# EAGLE design hybrid (EAGLE 8.0.2)

## Sheet 1 of 2
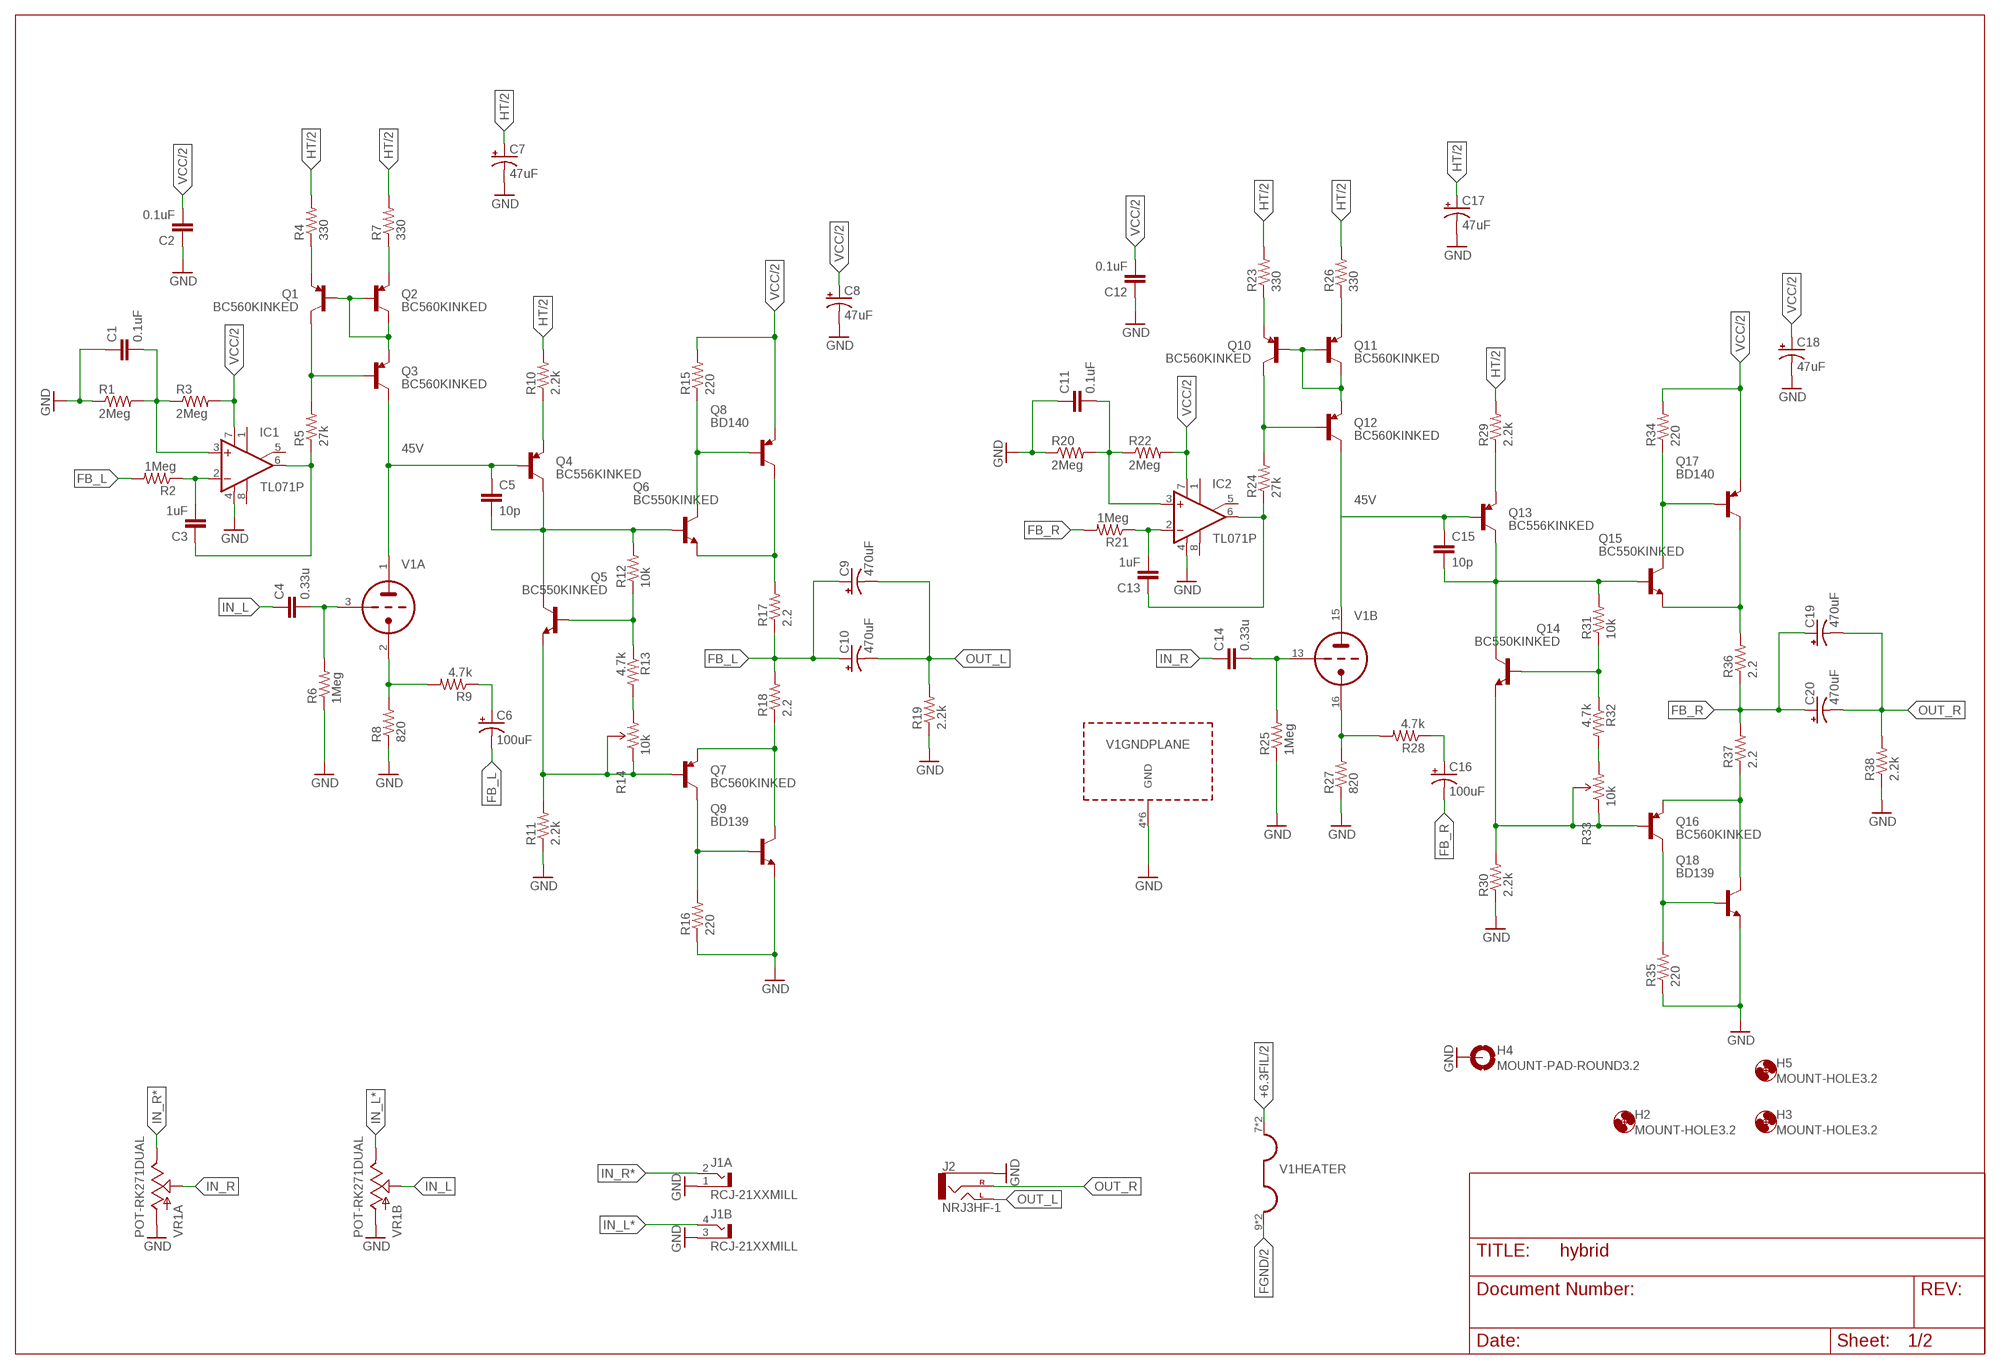
[diagram p0: schematic, sheet 1]

### Parts
C1  0.1uF  CAPPTH  [CAP-PTH-SMALL]
C2  0.1uF  CAPPTH  [CAP-PTH-SMALL]
C3  1uF  C5/5  [C5B5]
C4  0.33u  C5/3.5  [C5B3.5]
C5  10p  CAPPTH  [CAP-PTH-SMALL]
C6  100uF  CAP_POLPTH-8/3.5  [CPOL-RADIAL-8/3.5]
C7  47uF  CAP_POLPTH-8/3.5  [CPOL-RADIAL-8/3.5]
C8  47uF  CAP_POLPTH-8/3.5  [CPOL-RADIAL-8/3.5]
C9  470uF  CAP_POLPTH-12.5/5  [CPOL-RADIAL-12.5/5]
C10  470uF  CAP_POLPTH-12.5/5  [CPOL-RADIAL-12.5/5]
C11  0.1uF  CAPPTH  [CAP-PTH-SMALL]
C12  0.1uF  CAPPTH  [CAP-PTH-SMALL]
C13  1uF  C5/5  [C5B5]
C14  0.33u  C5/3.5  [C5B3.5]
C15  10p  CAPPTH  [CAP-PTH-SMALL]
C16  100uF  CAP_POLPTH-8/3.5  [CPOL-RADIAL-8/3.5]
C17  47uF  CAP_POLPTH-8/3.5  [CPOL-RADIAL-8/3.5]
C18  47uF  CAP_POLPTH-8/3.5  [CPOL-RADIAL-8/3.5]
C19  470uF  CAP_POLPTH-12.5/5  [CPOL-RADIAL-12.5/5]
C20  470uF  CAP_POLPTH-12.5/5  [CPOL-RADIAL-12.5/5]
H2  MOUNT-HOLE3.2  [3,2]
H3  MOUNT-HOLE3.2  [3,2]
H4  MOUNT-PAD-ROUND3.2  [3,2-PAD]
H5  MOUNT-HOLE3.2  [3,2]
IC1  TL071P  [DIL08]
IC2  TL071P  [DIL08]
J1  RCJ-21XXMILL  [RCJ-21-MILL]
J2  NRJ3HF-1  [NRJ3HF]
Q1  BC560KINKED  [TO92-BENT]
Q2  BC560KINKED  [TO92-BENT]
Q3  BC560KINKED  [TO92-BENT]
Q4  BC556KINKED  [TO92-BENT]
Q5  BC550KINKED  [TO92-BENT]
Q6  BC550KINKED  [TO92-BENT]
Q7  BC560KINKED  [TO92-BENT]
Q8  BD140  [TO126]
Q9  BD139  [TO126]
Q10  BC560KINKED  [TO92-BENT]
Q11  BC560KINKED  [TO92-BENT]
Q12  BC560KINKED  [TO92-BENT]
Q13  BC556KINKED  [TO92-BENT]
Q14  BC550KINKED  [TO92-BENT]
Q15  BC550KINKED  [TO92-BENT]
Q16  BC560KINKED  [TO92-BENT]
Q17  BD140  [TO126]
Q18  BD139  [TO126]
R1  2Meg  RESISTORPTH-1/4W  [AXIAL-0.4]
R2  1Meg  RESISTORPTH-1/4W  [AXIAL-0.4]
R3  2Meg  RESISTORPTH-1/4W  [AXIAL-0.4]
R4  330  RESISTORPTH-1/4W  [AXIAL-0.4]
R5  27k  RESISTORPTH-1/4W  [AXIAL-0.4]
R6  1Meg  RESISTORPTH-1/4W  [AXIAL-0.4]
R7  330  RESISTORPTH-1/4W  [AXIAL-0.4]
R8  820  RESISTORPTH-1/4W  [AXIAL-0.4]
R9  4.7k  RESISTORPTH-1/4W  [AXIAL-0.4]
R10  2.2k  RESISTORPTH-1/4W  [AXIAL-0.4]
R11  2.2k  RESISTORPTH-1/4W  [AXIAL-0.4]
R12  10k  RESISTORPTH-1/4W  [AXIAL-0.4]
R13  4.7k  RESISTORPTH-1/4W  [AXIAL-0.4]
R14  10k  TRIMPOT3362U-2  [3362U-2]
R15  220  RESISTORPTH-1/4W  [AXIAL-0.4]
R16  220  RESISTORPTH-1/4W  [AXIAL-0.4]
R17  2.2  RESISTORPTH-1/4W  [AXIAL-0.4]
R18  2.2  RESISTORPTH-1/4W  [AXIAL-0.4]
R19  2.2k  RESISTORPTH-1/4W  [AXIAL-0.4]
R20  2Meg  RESISTORPTH-1/4W  [AXIAL-0.4]
R21  1Meg  RESISTORPTH-1/4W  [AXIAL-0.4]
R22  2Meg  RESISTORPTH-1/4W  [AXIAL-0.4]
R23  330  RESISTORPTH-1/4W  [AXIAL-0.4]
R24  27k  RESISTORPTH-1/4W  [AXIAL-0.4]
R25  1Meg  RESISTORPTH-1/4W  [AXIAL-0.4]
R26  330  RESISTORPTH-1/4W  [AXIAL-0.4]
R27  820  RESISTORPTH-1/4W  [AXIAL-0.4]
R28  4.7k  RESISTORPTH-1/4W  [AXIAL-0.4]
R29  2.2k  RESISTORPTH-1/4W  [AXIAL-0.4]
R30  2.2k  RESISTORPTH-1/4W  [AXIAL-0.4]
R31  10k  RESISTORPTH-1/4W  [AXIAL-0.4]
R32  4.7k  RESISTORPTH-1/4W  [AXIAL-0.4]
R33  10k  TRIMPOT3362U-2  [3362U-2]
R34  220  RESISTORPTH-1/4W  [AXIAL-0.4]
R35  220  RESISTORPTH-1/4W  [AXIAL-0.4]
R36  2.2  RESISTORPTH-1/4W  [AXIAL-0.4]
R37  2.2  RESISTORPTH-1/4W  [AXIAL-0.4]
R38  2.2k  RESISTORPTH-1/4W  [AXIAL-0.4]
V1  6DJ8-P-HORIZONTAL  [NOVAL-HORIZONTAL]
VR1  POT-RK271DUAL  [RK271+PTD902]

### Nets
+6.3FIL [pwr]: V1.7(HEATER:H1) V1.8(HEATER:H1) ; also sheet 2
CAT_L: R8.P$2 R9.P$2 V1.2(A:TK)
CAT_R: R27.P$2 R28.P$2 V1.16(B:TK)
FB_L [out]: C6.2(-) C9.+ C10.+ R2.P$2 R17.P$1 R18.P$2
FB_R [out]: C16.2(-) C19.+ C20.+ R21.P$2 R36.P$1 R37.P$2
FGND [pwr]: V1.9(HEATER:H2) V1.10(HEATER:H2) ; also sheet 2
G_L: C4.2 R6.P$2 V1.3(A:TG)
G_R: C14.2 R25.P$2 V1.13(B:TG)
GND: C1.1 C2.1 C7.2(-) C8.2(-) C11.1 C12.1 C17.2(-) C18.2(-) H4.B3,2(MOUNT) IC1.4(V-) IC2.4(V-) J1.1(A:S) J1.3(B:S) J2.S(SLEEVE) Q9.1(E) Q18.1(E) R1.P$1 R6.P$1 R8.P$1 R11.P$1 R16.P$1 R19.P$1 R20.P$1 R25.P$1 R27.P$1 R30.P$1 R35.P$1 R38.P$1 V1.4(GNDPLANE:GND) V1.5(GNDPLANE:GND) V1.6(GNDPLANE:GND) V1.11(GNDPLANE:GND) V1.12(GNDPLANE:GND) V1.14(GNDPLANE:GND) VR1.1.1.1(A:A) VR1.1.1.2(A:A) VR1.2.1.1(B:A) VR1.2.1.2(B:A) ; also sheet 2
HT [pwr]: C7.1(+) C17.1(+) R4.P$2 R7.P$2 R10.P$2 R23.P$2 R26.P$2 R29.P$2 ; also sheet 2
IN_L: C4.1 VR1.2.2.1(B:S) VR1.2.2.2(B:S)
IN_L*: J1.4(B:T) VR1.2.3.1(B:E) VR1.2.3.2(B:E)
IN_R: C14.1 VR1.1.2(A:S)
IN_R*: J1.2(A:T) VR1.1.3.1(A:E) VR1.1.3.2(A:E)
ISET_L: Q1.1(C) Q3.2(B) R5.P$2
ISET_R: Q10.1(C) Q12.2(B) R24.P$2
N$1: Q1.2(B) Q2.1(C) Q2.2(B) Q3.3(E)
N$2: Q2.3(E) R7.P$1
N$3: Q1.3(E) R4.P$1
N$4: C6.1(+) R9.P$1
N$5: Q4.3(E) R10.P$1
N$7: C5.2 Q4.1(C) Q5.1(C) Q6.2(B) R12.P$2
N$8: Q5.2(B) R12.P$1 R13.P$1
N$10: R13.P$2 R14.3(CW)
N$11 [out]: Q6.3(E) Q8.2(C) R17.P$2
N$12: Q5.3(E) Q7.2(B) R11.P$2 R14.1(CCW) R14.2(WIPER)
N$13 [out]: Q7.3(E) Q9.2(C) R18.P$1
N$14: Q6.1(C) Q8.3(B) R15.P$1
N$15: Q7.1(C) Q9.3(B) R16.P$2
N$16: Q11.3(E) R26.P$1
N$17: Q10.2(B) Q11.1(C) Q11.2(B) Q12.3(E)
N$19: C16.1(+) R28.P$1
N$20: Q13.3(E) R29.P$1
N$21: C15.2 Q13.1(C) Q14.1(C) Q15.2(B) R31.P$2
N$22: Q14.2(B) R31.P$1 R32.P$1
N$23: R32.P$2 R33.3(CW)
N$24: Q14.3(E) Q16.2(B) R30.P$2 R33.1(CCW) R33.2(WIPER)
N$25 [out]: Q15.3(E) Q17.2(C) R36.P$2
N$26 [out]: Q16.3(E) Q18.2(C) R37.P$1
N$27: Q15.1(C) Q17.3(B) R34.P$1
N$28: Q16.1(C) Q18.3(B) R35.P$2
N$29: C3.1 IC1.6(OUT) R5.P$1
N$35: C3.2 IC1.2(-IN) R2.P$1
N$38: C1.2 IC1.3(+IN) R1.P$2 R3.P$1
N$39: Q10.3(E) R23.P$1
N$41: C13.1 IC2.6(OUT) R24.P$1
N$42: C13.2 IC2.2(-IN) R21.P$1
N$43: C11.2 IC2.3(+IN) R20.P$2 R22.P$1
OUT_L [out]: C9.- C10.- J2.T(LEFT) R19.P$2
OUT_R [out]: C19.- C20.- J2.R(RIGHT) R38.P$2
PL_L: C5.1 Q3.1(C) Q4.2(B) V1.1(A:TA)
PL_R: C15.1 Q12.1(C) Q13.2(B) V1.15(B:TA)
VCC [pwr]: C2.2 C8.1(+) C12.2 C18.1(+) IC1.7(V+) IC2.7(V+) Q8.1(E) Q17.1(E) R3.P$2 R15.P$2 R22.P$2 R34.P$2 ; also sheet 2
Unconnected: IC1.1(ON1) IC1.5(ON2) IC1.8(OPT) IC2.1(ON1) IC2.5(ON2) IC2.8(OPT)

### Notes on the sheet
- 45V
- 45V

## Sheet 2 of 2
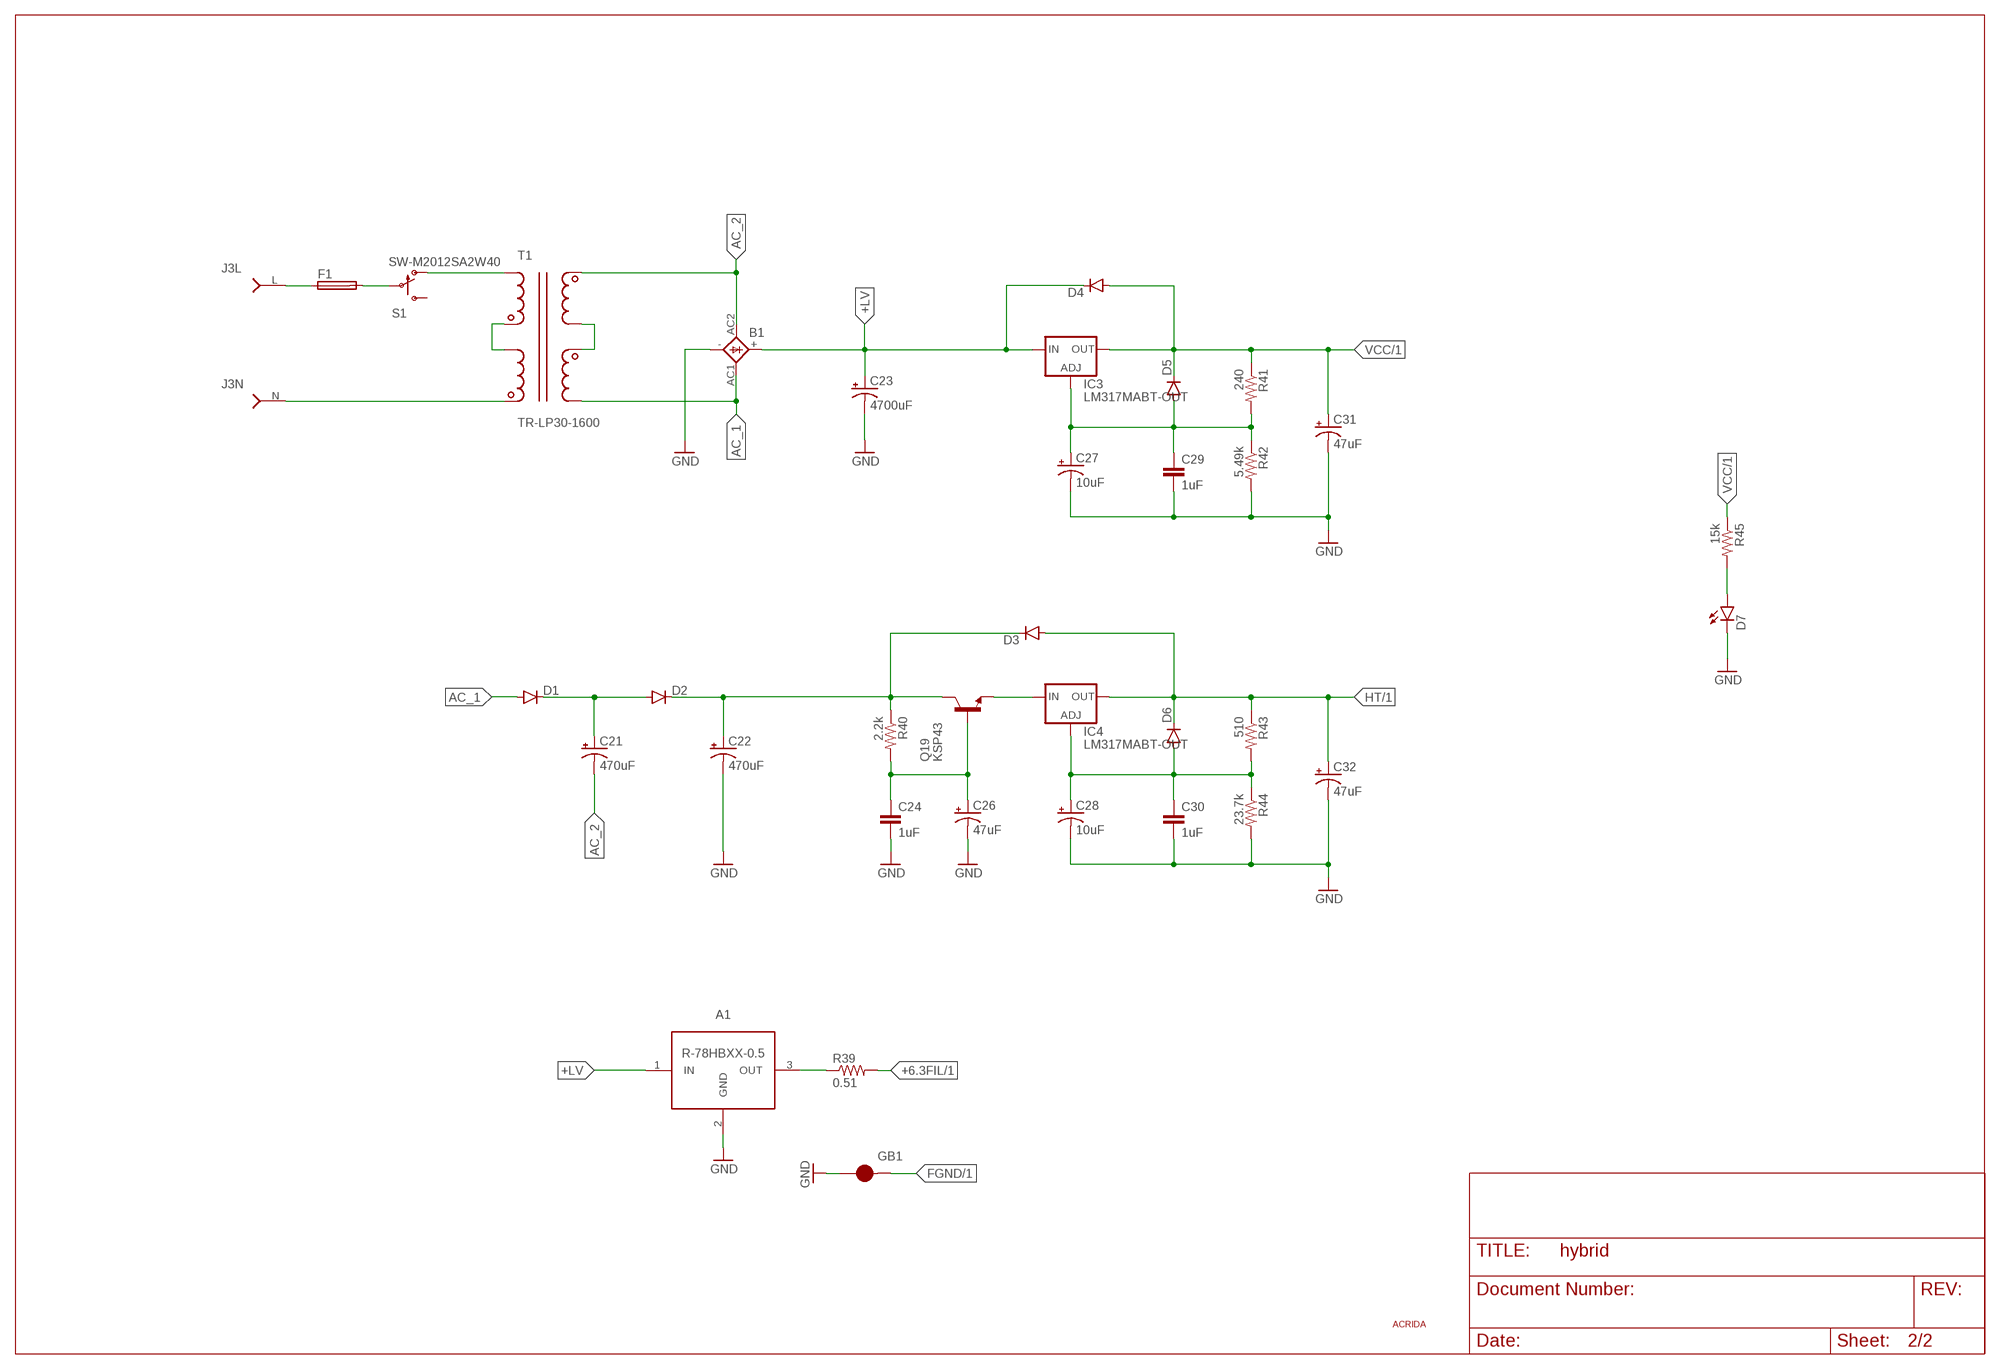
[diagram p1: schematic, sheet 2]

### Parts
A1  R-78HBXX-0.5  [R-78HB]
B1  GBU4  [GBU4S]
C21  470uF  CAP_POLPTH-18/7.5  [CPOL-RADIAL-18/7.5]
C22  470uF  CAP_POLPTH-18/7.5  [CPOL-RADIAL-18/7.5]
C23  4700uF  CAP_POLSNAPIN-30/10  [CPOL-SNAPIN-30/10]
C24  1uF  CAPPTH  [CAP-PTH-SMALL]
C26  47uF  CAP_POLPTH-12/5  [CPOL-RADIAL-12/5]
C27  10uF  CAP_POLPTH-5/2.5  [CPOL-RADIAL-5/2.5]
C28  10uF  CAP_POLPTH-6.5/2.5  [CPOL-RADIAL-6.5/2.5]
C29  1uF  CAPPTH  [CAP-PTH-SMALL]
C30  1uF  CAPPTH  [CAP-PTH-SMALL]
C31  47uF  CAP_POLPTH-8/3.5  [CPOL-RADIAL-8/3.5]
C32  47uF  CAP_POLPTH-8/3.5  [CPOL-RADIAL-8/3.5]
D1  DIODEPTH  [DIODE-1N4001]
D2  DIODEPTH  [DIODE-1N4001]
D3  DIODEPTH  [DIODE-1N4001]
D4  DIODEPTH  [DIODE-1N4001]
D5  DIODEPTH  [DIODE-1N4001]
D6  DIODEPTH  [DIODE-1N4001]
D7  LED3MM  [LED3MM]
F1  SH22,5  [SH22,5]
GB1  COPPER-BRIDGESM  [COPPER-BRIDGE-SM]
IC3  LM317MABT-OUT  [TO220L1-OUT]
IC4  LM317MABT-OUT  [TO220L1-OUT]
J3  703W-00/54  [703W-00/54]
Q19  KSP43  [TO-92]
R39  0.51  RESISTORPTH-1/2W  [AXIAL-0.5]
R40  2.2k  RESISTORPTH-1/4W  [AXIAL-0.4]
R41  240  RESISTORPTH-1/4W  [AXIAL-0.4]
R42  5.49k  RESISTORPTH-1/4W  [AXIAL-0.4]
R43  510  RESISTORPTH-1/4W  [AXIAL-0.4]
R44  23.7k  RESISTORPTH-1/4W  [AXIAL-0.4]
R45  15k  RESISTORPTH-1/4W  [AXIAL-0.4]
S1  SW-M2012SA2W40  [SW-M2012S2A2G40]
T1  TR-LP30-1600  [TR-LP30-1600]
U$1  ACRIDA-LOGO  [ACRIDA-LOGO]

### Nets
+6.3FIL [pwr]: R39.P$2 ; also sheet 1
+LV [pwr]: A1.1(IN) B1.+ C23.1(+) D4.C IC3.3(IN)
AC_1: B1.AC1(AC2) D1.A T1.8
AC_2: B1.AC2(AC1) C21.2(-) T1.5
FGND [pwr]: GB1.2 ; also sheet 1
GND: A1.2(GND) B1.- C22.2(-) C23.2(-) C24.2 C26.- C27.2(-) C28.2(-) C29.2 C30.2 C31.2(-) C32.2(-) D7.K(C) GB1.1 R42.P$2 R44.P$2 ; also sheet 1
HT [pwr]: C32.1(+) D3.A D6.C IC4.2(OUT) R43.P$1 ; also sheet 1
N$6: T1.2 T1.3
N$9: T1.6 T1.7
N$18: J3.N T1.1
N$30: C27.1(+) C29.1 D5.A IC3.1(ADJ) R41.P$2 R42.P$1
N$31 [pwr]: C21.1(+) D1.C D2.A
N$32 [pwr]: A1.3(OUT) R39.P$1
N$33 [pwr]: C22.1(+) D2.C D3.C Q19.3(C) R40.P$1
N$34: C24.1 C26.+ Q19.2(B) R40.P$2
N$36: C28.1(+) C30.1 D6.A IC4.1(ADJ) R43.P$2 R44.P$1
N$37 [pwr]: IC4.3(IN) Q19.1(E)
N$40: F1.1 J3.L
N$44: F1.2 S1.S(P)
N$45: S1.UP-CONNECT(O) T1.4
N$46: D7.A R45.P$2
VCC [pwr]: C31.1(+) D4.A D5.C IC3.2(OUT) R41.P$1 R45.P$1 ; also sheet 1
Unconnected: S1.DN-CONNECT(S)

## Power pins joined to a net without a drawn wire
P$1: J3.E

## Library data of the parts
A1 = my-smps:R-78HBXX-0.5: The R-78HBxx-Series high efficiency, high input voltage switching regulators are ideally suited to replace 78xx linear regulators and are pin compatible. http://www.mouser.com/ds/2/468/R-78HBxx-0.5_L-958370.pdf
B1 = rectifier:GBU4: GENERAL INSTRUMENT RECTIFIER
C1 C2 C5 C11 C12 C15 C24 C29 C30 = SparkFun-Capacitors:CAP: Capacitor Standard 0603 ceramic capacitor, and 0.1" leaded capacitor.
C3 C4 C13 C14 = capacitor-wima:C: CAPACITOR naming: grid - package width
C6-C10 C16-C23 C26-C28 C31 C32 = my-cap:CAP_POL: Capacitor Polarized These are standard SMD and PTH capacitors. Normally 10uF, 47uF, and 100uF in electrolytic and tantalum varieties. Always verify the external diameter of the through hole cap, it varies with capacity, voltage, and manufacturer. The EIA devices should be standard.
D1-D6 = SparkFun-DiscreteSemi:DIODE: Diode These are standard reverse protection diodes and small signal diodes. SMA package can handle up to about 1A. SOD-323 can handle about 200mA. What the SOD-323 package when ordering, there are some mfgs out there that are 5-pin packages.
D7 = SparkFun-LED:LED: LEDs Standard schematic elements and footprints for 5mm, 3mm, 1206, and 0603 sized LEDs. 5mm - Spark Fun Electronics SKU : COM-00529 (and others); PROD_ID: DIO-08794
F1 = fuse:SH22,5: FUSE HOLDER grid 22,5 mm, OGN0031 8201, Schurter (Buerklin); MF: SCHURTER; MPN: 0031.8201; OC_FARNELL: 1162740; OC_NEWARK: 96F8317
GB1 = my:COPPER-BRIDGE
H2 H3 H5 = holes:MOUNT-HOLE: MOUNTING HOLE with drill center marker
H4 = holes:MOUNT-PAD-ROUND: MOUNTING PAD, round
IC1 IC2 = linear:TL071: OP AMP
IC3 IC4 = my-reg:LM317?*: 500 mA Adjustable Output Positive Voltage Regulator Source: http://www.onsemi.co.jp .. LM317M-D.PDF
J1 = my:RCJ-21XX: Dual RCA Jack
J2 = my-conn:NRJ3HF-1: 1/4" Phone Jack
J3 = my-conn:703W-00/54: Qualtek 703W-00/54
Q1-Q3 Q7 Q10-Q12 Q16 = my-tran:BC560
Q4 Q13 = my-tran:BC556
Q5 Q6 Q14 Q15 = my-tran:BC550: NPN Epitaxial Silicon Transistor
Q8 Q17 = transistor-pnp:BD140: PNP Transistor
Q9 Q18 = transistor-npn:BD139*: NPN Transistor
Q19 = my-tran:KSP43
R1-R13 R15-R32 R34-R38 R40-R45 = SparkFun-Resistors:RESISTOR: Resistor Basic schematic elements and footprints for 0603, 1206, and PTH resistors.
R14 R33 = SparkFun-Electromechanical:TRIMPOT: Various small potentiometers for "set-and-forget" applications
R39 = my-res:RESISTOR: Resistor Basic schematic elements and footprints for 0603, 1206, and PTH resistors.
S1 = my-sw:SW-M2012SA2W40
T1 = my-transformers:TR-LP30-1600: http://www.mouser.com/ds/2/643/LP-892507.pdf
U$1 = my-logo:ACRIDA-LOGO
V1 = my-tubes:6DJ8-P-HORIZONTAL
VR1 = my:POT-RK271: 27mm Size Metal Shaft Type RK271 Series Rotary Potentiometer

## Net classes
1 out: width 0.813 mm
2 pwr: width 1.27 mm

## Board
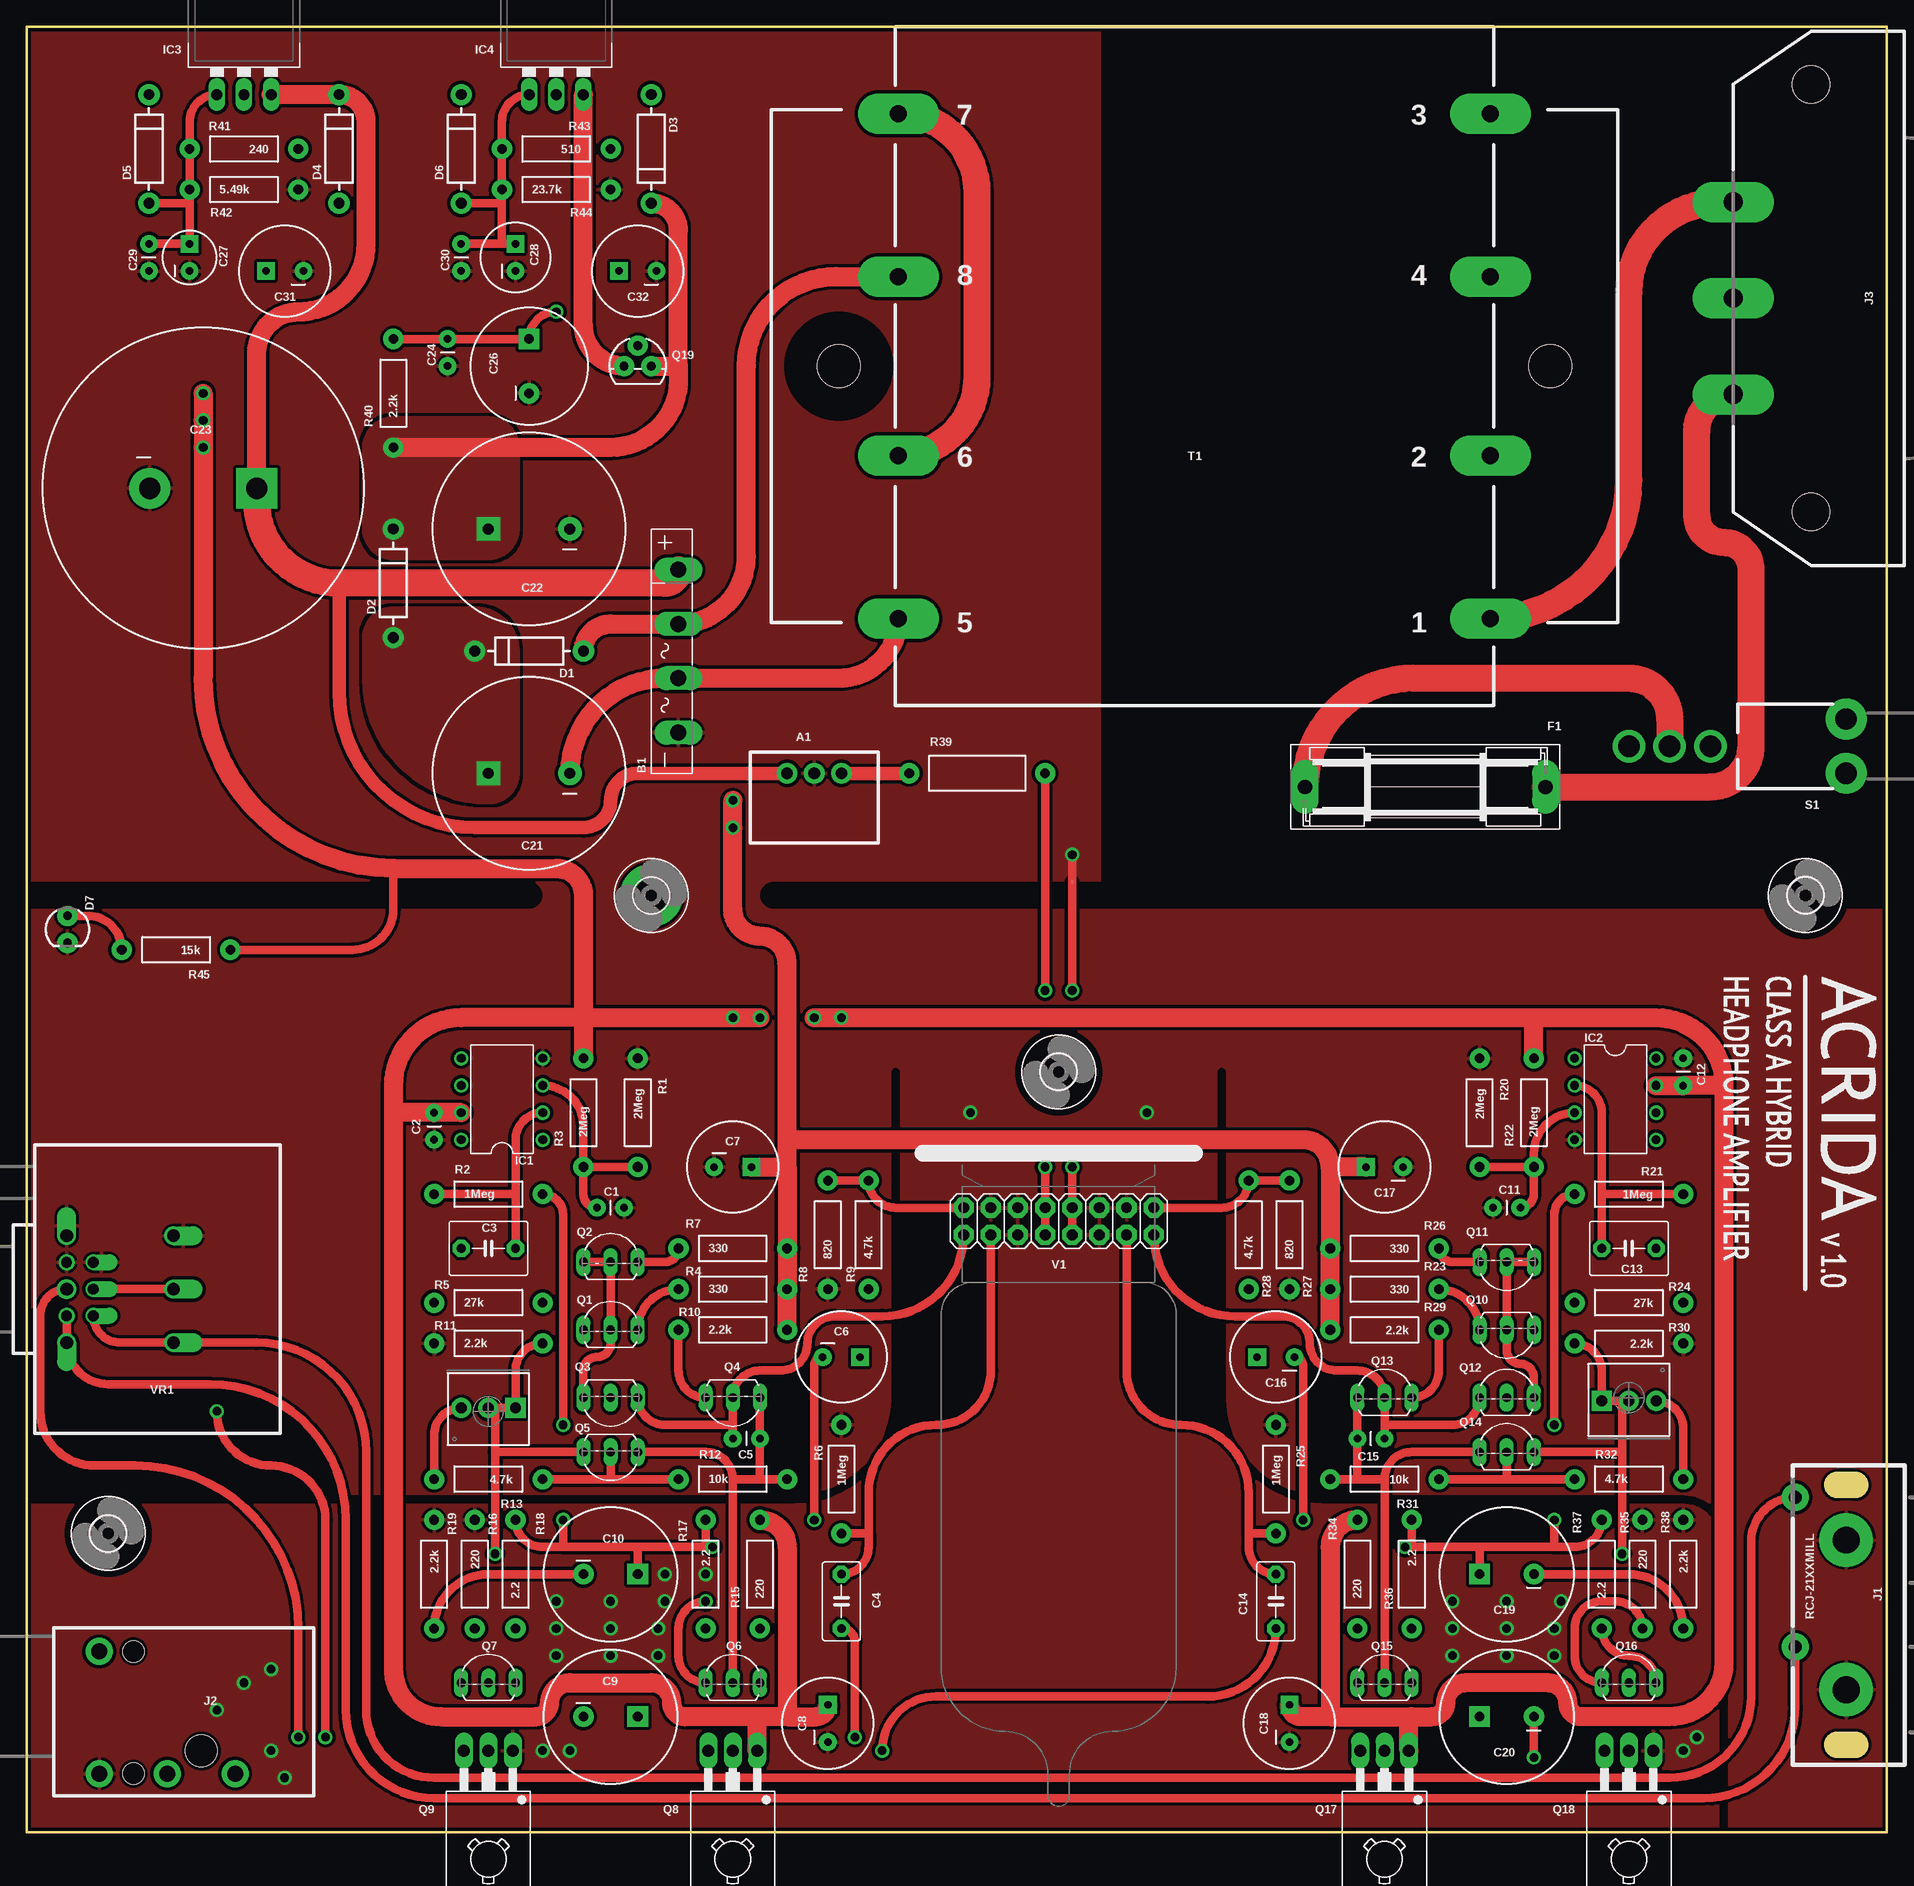
[diagram p2: board, top side]
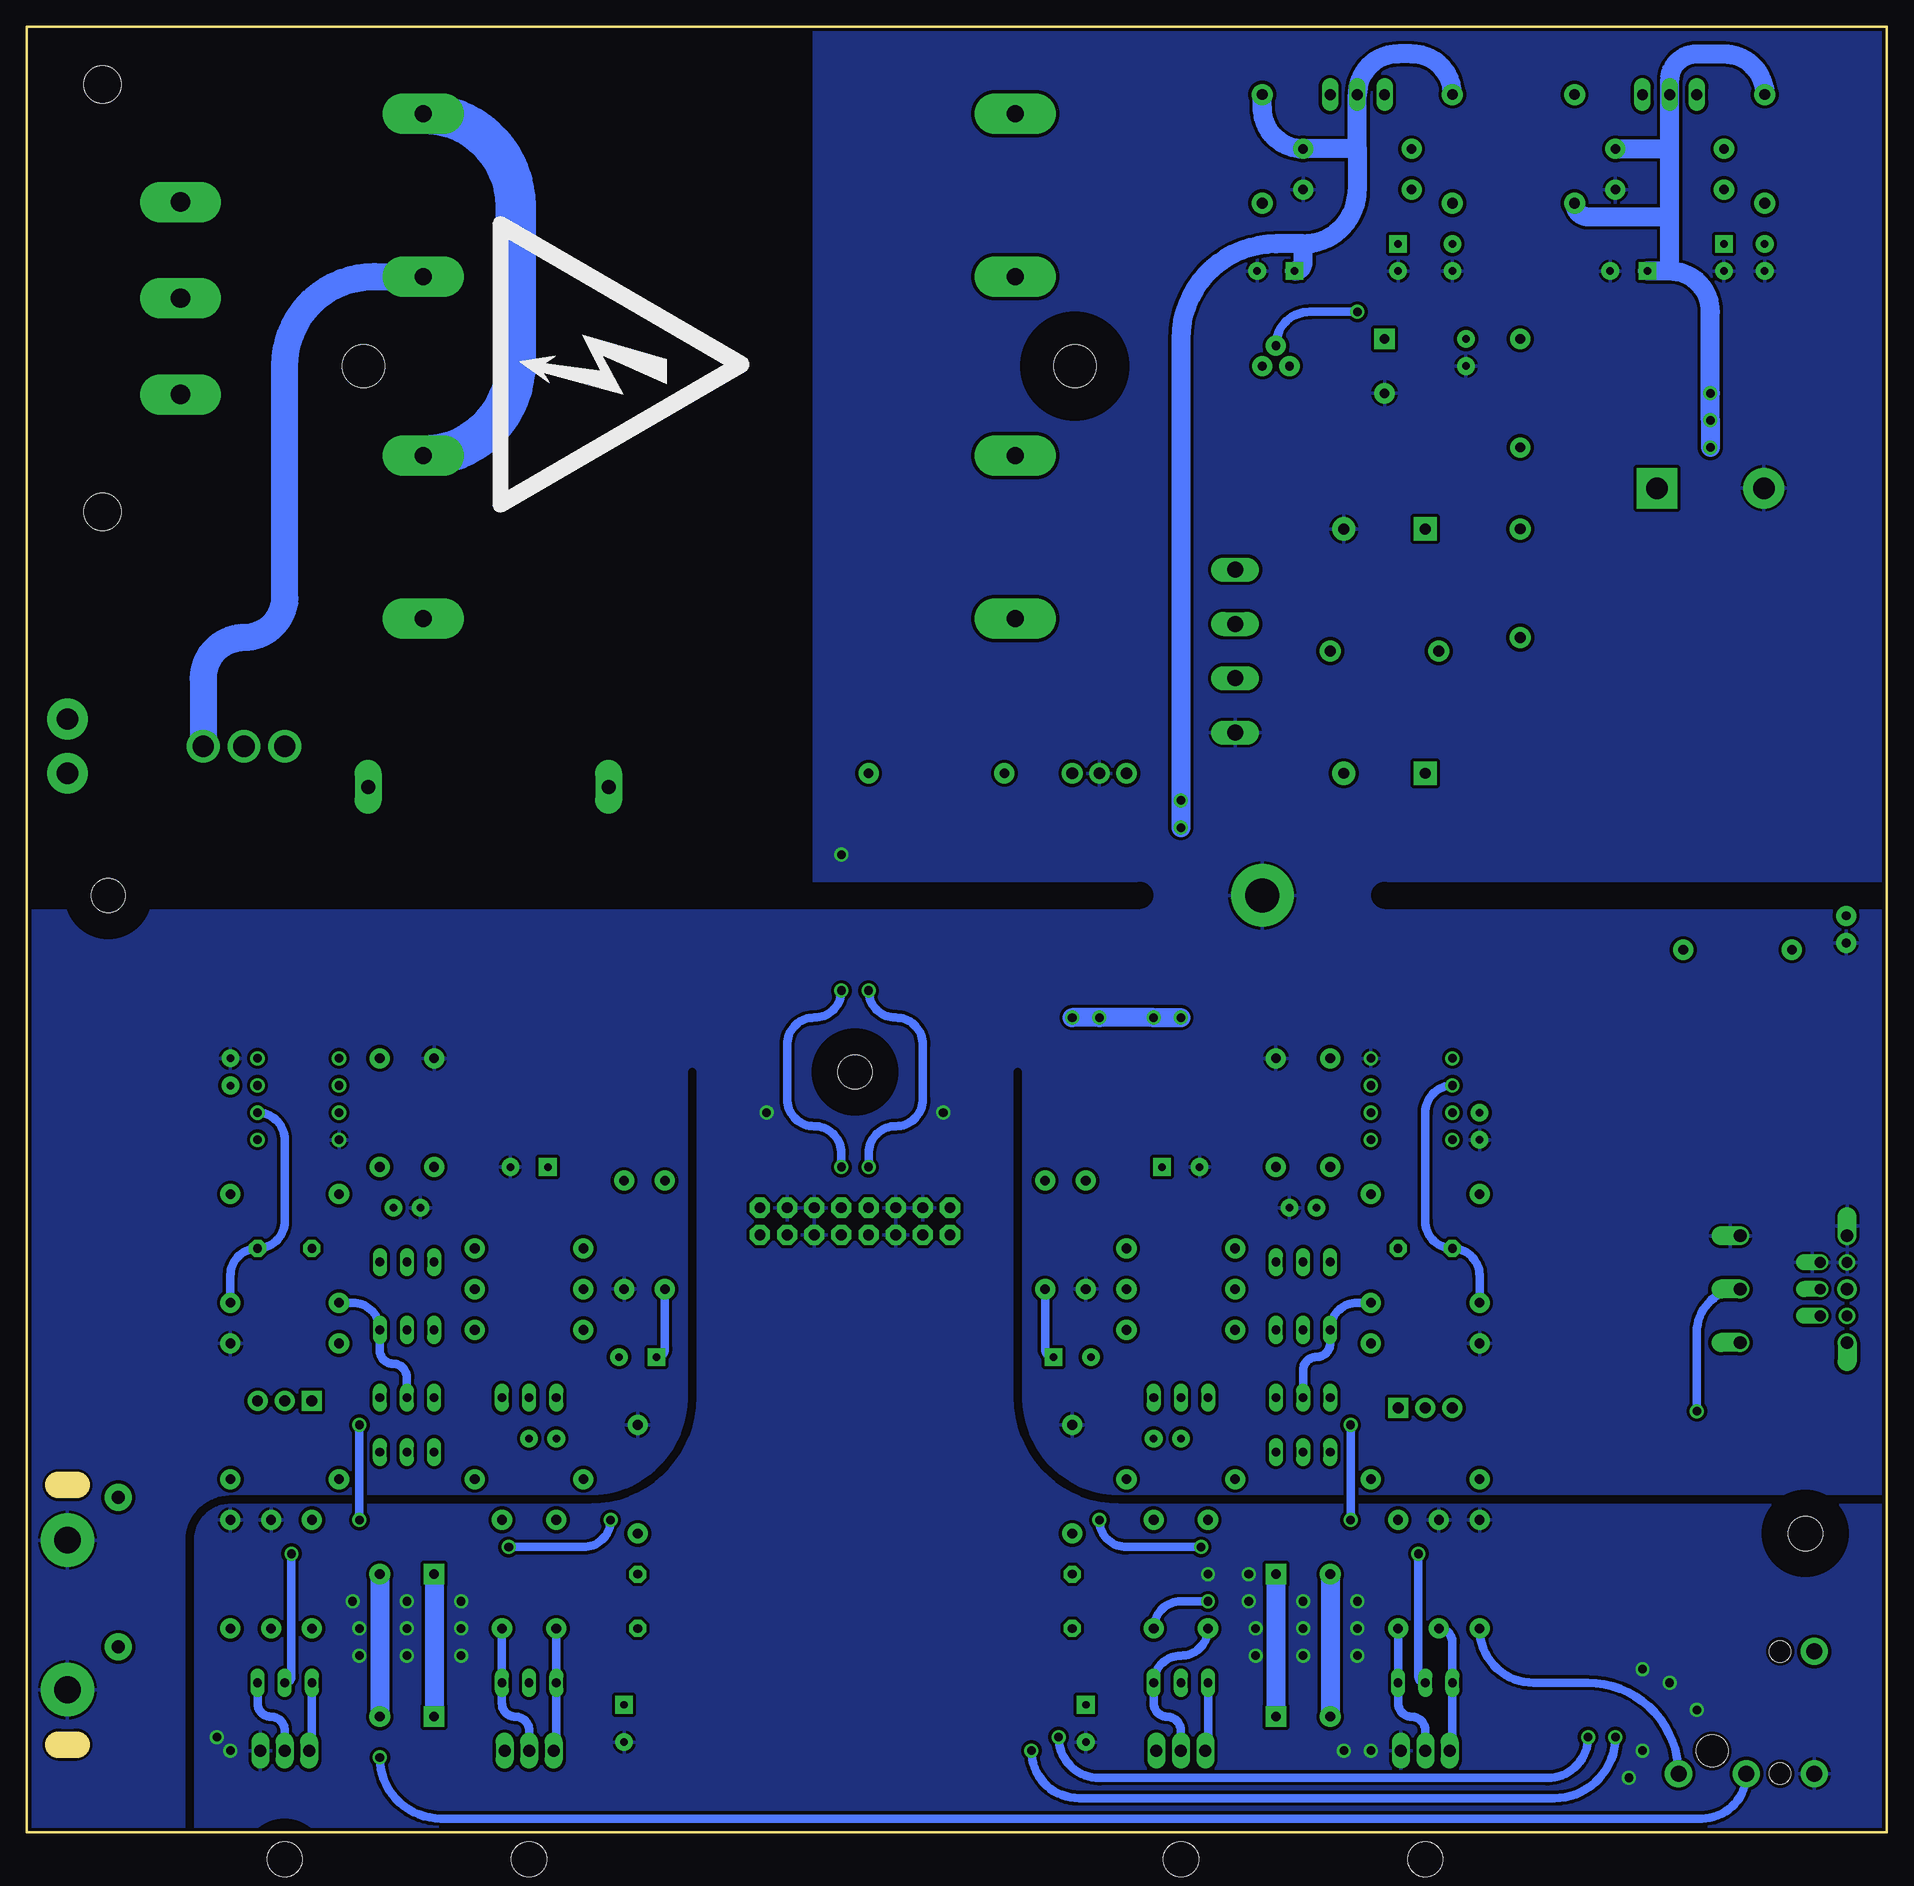
[diagram p3: board, bottom side, seen from below]

Size 173.99 x 168.91 mm. Coordinates in mm from the lower left corner, seen from the top.
Outline: 0,168.91 173.99,168.91 173.99,0 0,0 0,168.91
Copper layers (1*16): Top 0.035mm / dielectric 1.5mm / Bottom 0.035mm
Design rules "SeeedStudio_2layer_DRU_no_angle_20140221 *": minimum track width 12mil, minimum drill 12mil, track to track 12mil, track to pad 12mil, pad to pad 12mil, via to via 12mil, smd to smd 0mil, copper to edge 12mil, drill to drill 12mil, minimum pad ring 10mil, minimum via ring 10mil, stop-mask expansion 2mil, vias tented up to drill 100mil, thermal gap 10mil
tRestrict: 10 lines
bRestrict: 10 lines

### Footprints (pad centres in the part's own frame; a part is rotated, then mirrored left to right if it is on the bottom)
R-78HB = drill 1.1 pad 1.93: 1 -2.54,0; 2 0,0; 3 2.54,0
GBU4S = drill 1.499 long: + 7.62,0; - -7.62,0; AC1 2.54,0; AC2 -2.54,0
CAP-PTH-SMALL = drill 0.7 pad 1.651: 1 0,0; 2 2.54,0
C5B5 = drill 0.813 pad 1.6 octagon: 1 -2.54,0; 2 2.54,0
C5B3.5 = drill 0.813 pad 1.6 octagon: 1 -2.54,0; 2 2.54,0
CPOL-RADIAL-8/3.5 = drill 0.7 pad 1.651 square: 1 1.75,0 | drill 0.7 pad 1.651: 2 -1.75,0
CPOL-RADIAL-12.5/5 = drill 0.9 pad 1.93 square: + 2.54,0 | drill 0.9 pad 1.93: - -2.54,0
CPOL-RADIAL-18/7.5 = drill 1.016 pad 2.184 square: 1 3.81,0 | drill 1.016 pad 2.184: 2 -3.81,0
CPOL-SNAPIN-30/10 = drill 2 pad 3.81 square: 1 5,0 | drill 2 pad 3.81: 2 -5,0
CPOL-RADIAL-12/5 = drill 0.9 pad 1.93 square: + 2.54,0 | drill 0.9 pad 1.93: - -2.54,0
CPOL-RADIAL-5/2.5 = drill 0.7 pad 1.651 square: 1 1.27,0 | drill 0.7 pad 1.651: 2 -1.27,0
CPOL-RADIAL-6.5/2.5 = drill 0.7 pad 1.651 square: 1 1.27,0 | drill 0.7 pad 1.651: 2 -1.27,0
DIODE-1N4001 = drill 1 pad 1.981: A -5.08,0; C 5.08,0
LED3MM = drill 0.813 pad 1.88: A -1.27,0; K 1.27,0
SH22,5 = drill 1.321 pad 2.54 long: 1 -11.252,0; 2 11.252,0
COPPER-BRIDGE-SM = smd 0.203 x 0.203: 1 0,0; 2 0,0
3,2 = hole 3.2: 0,0
3,2-PAD = drill 3.2 pad 5.842: B3,2 0,0
DIL08 = drill 0.813 pad 1.27: 1 -3.81,-3.81; 2 -1.27,-3.81; 3 1.27,-3.81; 4 3.81,-3.81; 5 3.81,3.81; 6 1.27,3.81; 7 -1.27,3.81; 8 -3.81,3.81
TO220L1-OUT = drill 1.016 long: 1 -2.54,-3.81; 2 0,-3.81; 3 2.54,-3.81
RCJ-21-MILL = drill 2.5 pad 5: 1 7,0; 3 -7,0 | drill 1.2 pad 2.54: 2 3,-4.75; 4 -11,-4.75
NRJ3HF = drill 1.5 pad 2.54: G -4.25,-4.2; R -10.6,7.23; S -4.25,7.23; T -16.95,7.23 | hole 2: -7.45,7.23; -7.45,-4.2 | hole 3: -13.8,5.1
703W-00/54 = drill 1.8 pad 3.81 long: E 0,-9.3; L 9,-9.3; N -9,-9.3 | hole 3.5: -20,-2; 20,-2
TO92-BENT = drill 0.813 long: 1 -2.54,-1.27; 2 0,-1.27; 3 2.54,-1.27
TO126 = drill 1.118 long: 1 -2.286,-5.08; 2 0,-5.08; 3 2.286,-5.08 | hole 3.302: 0,5.08
TO-92 = drill 0.813 pad 1.88: 1 -1.27,0; 2 0,1.905; 3 1.27,0
AXIAL-0.4 = drill 0.9 pad 1.88: P$1 -5.08,0; P$2 5.08,0
3362U-2 = drill 1.016 pad 1.88 square: 1 -2.54,-0.305 | drill 1.016 pad 1.88: 2 0,-0.305; 3 2.54,-0.305
AXIAL-0.5 = drill 0.9 pad 1.88: P$1 -6.35,0; P$2 6.35,0
SW-M2012S2A2G40 = drill 2 pad 3.048: DN-CONNECT 0,20.32; S 0,16.51; UP-CONNECT 0,12.7 | drill 2 pad 3.81: G1 -2.54,0; G2 2.54,0
TR-LP30-1600 = drill 1.6 pad 3.81 long: 1 -27.686,23.622; 2 -27.686,8.382; 3 -27.686,-23.622; 4 -27.686,-8.382; 5 27.686,23.622; 6 27.686,8.382; 7 27.686,-23.622; 8 27.686,-8.382 | hole 4: -33.274,0; 33.274,0
NOVAL-HORIZONTAL = drill 1.016 pad 1.88 octagon: 1 -8.89,0; 2 -8.89,2.54; 3 -6.35,0; 4 -6.35,2.54; 5 -3.81,0; 6 -3.81,2.54; 7 -1.27,0; 8 -1.27,2.54; 9 1.27,0; 10 1.27,2.54; 11 3.81,0; 12 3.81,2.54; 13 6.35,0; 14 6.35,2.54; 15 8.89,0; 16 8.89,2.54
RK271+PTD902 = drill 1.2 offset: 1.1.1 -5,-5; 1.3.1 -5,5; 2.1.1 -15,-5; 2.2.1 -15,0; 2.3.1 -15,5 | drill 1: 1.1.2 -5,-2.5; 1.3.2 -5,2.5 | drill 1.2: 1.2 -5,0 | drill 1 offset: 2.1.2 -7.5,-2.5; 2.2.2 -7.5,0; 2.3.2 -7.5,2.5

### Placement (x,y rotation side)
A1  73.66,99.06 0 top
B1  60.96,110.49 90 top
C1  55.88,58.42 180 top
C2  38.1,64.77 90 top
C3  43.18,54.61 0 top
C4  76.2,21.59 90 top
C5  66.04,36.83 0 top
C6  76.2,44.45 0 top
C7  66.04,62.23 0 top
C8  74.93,10.16 90 top
C9  54.61,10.79 0 top
C10  54.61,24.13 0 top
C11  137.16,58.42 0 top
C12  154.94,72.39 270 top
C13  149.86,54.61 180 top
C14  116.84,21.59 90 top
C15  127,36.83 180 top
C16  116.84,44.45 180 top
C17  127,62.23 180 top
C18  118.11,10.16 90 top
C19  138.43,24.13 180 top
C20  138.43,10.79 180 top
C21  46.99,99.06 180 top
C22  46.99,121.92 180 top
C23  16.51,125.73 0 top
C24  39.37,139.7 270 top
C26  46.99,137.16 90 top
C27  15.24,147.32 90 top
C28  45.72,147.32 90 top
C29  11.43,148.59 270 top
C30  40.64,148.59 270 top
C31  24.13,146.05 180 top
C32  57.15,146.05 180 top
D1  46.99,110.49 180 top
D2  34.29,116.84 90 top
D3  58.42,157.48 270 top
D4  29.21,157.48 90 top
D5  11.43,157.48 90 top
D6  40.64,157.48 90 top
D7  3.81,84.45 270 top
F1  130.81,97.79 180 top
GB1  97.79,88.9 0 top
H2  166.37,87.63 0 top
H3  96.52,71.12 0 top
H4  58.42,87.63 0 top
H5  7.62,27.94 0 top
IC1  44.45,68.58 90 top
IC2  148.59,68.58 270 top
IC3  20.32,166.37 0 top
IC4  49.53,166.37 0 top
J1  170.18,20.32 270 top
J2  2.54,12.7 180 top
J3  168.91,143.51 270 top
Q1  54.61,48.26 0 top
Q2  54.61,54.61 0 top
Q3  54.61,39.37 180 top
Q4  66.04,39.37 180 top
Q5  54.61,34.29 180 top
Q6  66.04,15.24 0 top
Q7  43.18,15.24 0 top
Q8  66.04,2.54 180 top
Q9  43.18,2.54 180 top
Q10  138.43,45.72 180 top
Q11  138.43,52.07 180 top
Q12  138.43,41.91 0 top
Q13  127,41.91 0 top
Q14  138.43,36.83 0 top
Q15  127,15.24 0 top
Q16  149.86,15.24 0 top
Q17  127,2.54 180 top
Q18  149.86,2.54 180 top
Q19  57.15,137.16 0 top
R1  57.15,67.31 270 top
R2  43.18,59.69 0 top
R3  52.07,67.31 90 top
R4  66.04,50.8 0 top
R5  43.18,49.53 0 top
R6  76.2,33.02 270 top
R7  66.04,54.61 0 top
R8  74.93,55.88 90 top
R9  78.74,55.88 90 top
R10  66.04,46.99 0 top
R11  43.18,45.72 0 top
R12  66.04,33.02 0 top
R13  43.18,33.02 180 top
R14  43.18,39.37 180 top
R15  68.58,24.13 90 top
R16  41.91,24.13 270 top
R17  63.5,24.13 270 top
R18  45.72,24.13 90 top
R19  38.1,24.13 270 top
R20  135.89,67.31 270 top
R21  149.86,59.69 180 top
R22  140.97,67.31 90 top
R23  127,50.8 180 top
R24  149.86,49.53 180 top
R25  116.84,33.02 270 top
R26  127,54.61 180 top
R27  118.11,55.88 90 top
R28  114.3,55.88 90 top
R29  127,46.99 180 top
R30  149.86,45.72 180 top
R31  127,33.02 180 top
R32  149.86,33.02 0 top
R33  149.86,40.64 0 top
R34  124.46,24.13 90 top
R35  151.13,24.13 270 top
R36  129.54,24.13 270 top
R37  147.32,24.13 90 top
R38  154.94,24.13 270 top
R39  88.9,99.06 0 top
R40  34.29,134.62 90 top
R41  20.32,157.48 180 top
R42  20.32,153.67 0 top
R43  49.53,157.48 180 top
R44  49.53,153.67 0 top
R45  13.97,82.55 180 top
S1  170.18,101.6 90 top
T1  109.22,137.16 180 top
U$1  158.75,80.01 270 top
U$2  [DANGER-LOGO]  130.81,151.13 270 bottom
V1  96.52,55.88 0 top
VR1  -1.27,50.8 180 top

### Tracks (layer width: path | path; a pad name or v marks a point on that pad's centre or on a via)
+6.3FIL  (via drill 0.8)
  Top 0.813: v95.25,78.74 R39.P$2 | V1.7 V1.8 v95.25,62.23
  Bottom 0.813: v95.25,62.23 95.25,63.5 arc90 92.71,66.04 arc-90 90.17,68.58 90.17,73.66 arc-90 92.71,76.2 arc90 v95.25,78.74
+LV
  Top 1.27: A1.1 57.15,99.06 arc90 54.61,96.52 arc-90 52.07,93.98 41.91,93.98 arc-90 29.21,106.68 29.21,116.84
  Top 1.778: IC3.3 D4.C arc-90 31.75,160.02 31.75,148.59 arc-90 25.4,142.24 arc90 21.51,138.35 C23.1
  Top 2.54: B1.+ arc-90 59.69,116.84 29.21,116.84 arc-90 21.51,124.54 C23.1
AC_1
  Top 1.778: D1.A arc-90 54.61,113.03 B1.AC1 arc90 67.31,119.38 67.31,137.16 arc-90 75.69,145.54 T1.8
AC_2
  Top 1.778: C21.2 arc-90 59.69,107.95 B1.AC2 75.95,107.95 arc90 T1.5
CAT_L
  Top 0.813: R8.P$2 R9.P$2 arc90 81.28,58.42 V1.2
CAT_R
  Top 0.813: R27.P$2 R28.P$2 arc-90 111.76,58.42 V1.16
FB_L  (via drill 0.8)
  Top 0.813: v50.16,38.1 50.16,57.78 arc90 R2.P$2 | R18.P$2 arc90 48.26,26.67 50.16,26.67 | 57.15,26.67 63.5,26.67 | 50.16,26.67 57.15,26.67 | C10.+ 57.15,26.67 | v50.16,29.21 50.16,26.67 | R17.P$1 63.5,26.67 | 63.5,26.67 v64.14,26.67 | v73.66,29.21 73.66,43.66 arc-90 C6.2
  Bottom 0.813: v50.16,38.1 v50.16,29.21 | v73.66,29.21 arc-90 71.12,26.67 v64.14,26.67
  Bottom 1.778: C10.+ C9.+
FB_R  (via drill 0.8)
  Top 0.813: v142.88,38.1 142.88,57.78 arc-90 R21.P$2 | R37.P$2 arc-90 144.78,26.67 142.88,26.67 | 135.89,26.67 129.54,26.67 | 142.88,26.67 135.89,26.67 | C19.+ 135.89,26.67 | R36.P$1 129.54,26.67 | v142.88,29.21 142.88,26.67 | 129.54,26.67 v128.91,26.67 | v119.38,29.21 119.38,43.66 arc90 C16.2
  Bottom 0.813: v142.88,38.1 v142.88,29.21 | v128.91,26.67 121.92,26.67 arc-90 v119.38,29.21
  Bottom 1.778: C19.+ C20.+
FGND  (via drill 0.8)
  Top 0.813: v97.79,78.74 GB1.2 | V1.9 V1.10 v97.79,62.23
  Bottom 0.813: v97.79,62.23 97.79,63.5 arc-90 100.33,66.04 arc90 102.87,68.58 102.87,73.66 arc90 100.33,76.2 arc-90 v97.79,78.74
G_L
  Top 0.813: C4.2 arc90 78.74,26.67 78.74,27.94 | 78.74,27.94 78.74,31.75 arc-90 85.09,38.1 arc90 90.17,43.18 V1.3 | R6.P$2 78.74,27.94
G_R
  Top 0.813: C14.2 arc-90 114.3,26.67 114.3,27.94 | 114.3,27.94 114.3,31.75 arc90 107.95,38.1 arc-90 102.87,43.18 V1.13 | R25.P$2 114.3,27.94
GND  (via drill 0.8)
  Top 0.813: GB1.1 v97.79,91.44
  other vias: 49.53,21.59 49.53,19.05 49.53,16.51 59.69,21.59 59.69,24.13 63.5,24.13 54.61,21.59 54.61,19.05 54.61,16.51 59.05,16.51 138.43,16.51 138.43,19.05 138.43,21.59 133.35,21.59 133.35,19.05 133.35,16.51 143.51,21.59 142.88,19.05 142.88,16.51 59.05,19.05 22.86,7.62 17.78,11.43 20.32,13.97 22.86,15.24 24.13,5.08 88.27,67.31 104.78,67.31 154.94,7.62 156.21,8.89 48.26,7.62 50.8,7.62
  pour Bottom: 0,168.91 100.33,168.91 100.33,87.63 173.99,87.63 173.99,0 0,0
  pour Top (rank 2): 0,168.91 0,0 173.99,0 173.99,87.63 100.33,87.63 100.33,168.91
HT  (via drill 0.8)
  Top 1.778: R10.P$2 R4.P$2 R7.P$2 71.12,62.23 | R29.P$2 R23.P$2 R26.P$2 121.92,62.23 | 121.92,62.23 arc90 119.38,64.77 71.12,64.77 | C7.1 71.12,62.23 | C17.1 121.92,62.23 | 71.12,62.23 71.12,64.77 | v66.04,96.52 v66.04,93.98 66.04,86.36 arc90 68.58,83.82 arc-90 71.12,81.28 71.12,64.77
  Bottom 1.778: D6.C arc-90 44.45,166.37 45.72,166.37 arc-90 IC4.2 49.53,157.48 | 49.53,157.48 49.53,153.67 arc90 54.61,148.59 | 54.61,148.59 57.15,148.59 arc-90 66.04,139.7 v66.04,96.52 v66.04,93.98 | C32.1 arc-90 54.61,146.84 54.61,148.59 | 49.53,157.48 R43.P$1 arc90 58.42,161.29 D3.A
IN_L  (via drill 0.8)
  Top 0.813: VR1.2.2.2 VR1.2.2.1 | v17.78,39.37 arc90 22.86,34.29 arc-90 27.94,29.21 v27.94,8.89 | v77.47,8.89 77.47,17.78 arc90 C4.1
  Bottom 0.813: VR1.2.2.1 arc-90 17.78,46.75 v17.78,39.37 | v27.94,8.89 arc90 31.75,5.08 73.66,5.08 arc90 v77.47,8.89
IN_L*
  Top 0.813: VR1.2.3.2 arc90 8.73,45.8 VR1.2.3.1 | 13.89,45.8 VR1.2.3.1 | 15.16,45.8 VR1.2.3.1 | VR1.2.3.1 21.51,45.8 arc-90 31.75,35.56 31.75,11.43 arc90 38.1,5.08 153.67,5.08 arc90 161.29,12.7 161.29,27.18 arc-90 J1.4
IN_R  (via drill 0.8)
  Top 0.813: VR1.1.2 arc90 1.27,48.34 1.27,39.37 arc90 6.35,34.29 10.16,34.29 arc-90 25.4,19.05 v25.4,8.89 | C14.1 arc-90 110.49,12.7 85.09,12.7 arc90 v80.01,7.62
  Bottom 0.813: v25.4,8.89 arc90 31.11,3.17 75.56,3.17 arc90 v80.01,7.62
IN_R*
  Top 0.813: VR1.1.3.2 VR1.1.3.1 arc90 7.62,41.91 17.14,41.91 arc-90 29.84,29.21 29.84,11.43 arc90 38.1,3.17 156.84,3.17 arc90 165.43,11.76 J1.2
ISET_L
  Bottom 0.813: Q3.2 54.61,43.18 arc90 53.34,44.45 arc-90 52.07,45.72 Q1.1 arc90 49.53,49.53 R5.P$2
ISET_R
  Bottom 0.813: Q12.2 138.43,42.55 arc-90 139.7,43.81 arc90 140.97,45.09 Q10.1 arc-90 143.51,49.53 R24.P$2
N$1
  Top 0.813: Q2.1 Q2.2 Q1.2 54.61,45.72 arc-90 53.34,44.45 arc90 52.07,43.18 Q3.3
N$2
  Top 0.813: Q2.3 59.69,53.34 arc90 R7.P$1
N$3
  Top 0.813: Q1.3 arc-90 R4.P$1
N$4
  Bottom 0.813: C6.1 arc90 78.74,45.24 R9.P$1
N$5
  Top 0.813: R10.P$1 60.96,43.18 arc90 Q4.3
N$6
  Bottom 3.81: T1.3 arc90 128.27,152.15 128.27,137.41 arc90 T1.2
N$7
  Top 0.813: 66.04,33.02 arc90 63.5,35.56 Q5.1 | Q4.1 C5.2 68.58,33.02 | 68.58,33.02 R12.P$2 | 68.58,33.02 66.04,33.02 | 66.04,33.02 Q6.2
N$8
  Top 0.813: R13.P$1 54.61,33.02 | 54.61,33.02 R12.P$1 | Q5.2 54.61,33.02
N$9
  Top 2.54: T1.6 arc90 88.9,136.14 88.9,153.42 arc90 T1.7
N$10
  Top 0.813: R13.P$2 38.1,37.13 arc-90 R14.3
N$11
  Bottom 0.813: Q8.2 66.04,9.53 arc-90 67.31,10.79 arc90 68.58,12.06 Q6.3 arc90 66.04,16.51 arc-90 R17.P$2
N$12  (via drill 0.8)
  Top 0.813: 43.81,39.67 R14.2 | 43.81,39.67 R14.1 45.72,43.18 arc-90 R11.P$2 | 43.81,39.67 43.81,35.56 | Q5.3 43.81,35.56 | 43.81,35.56 v43.81,26.04
  Bottom 0.813: v43.81,26.04 43.81,14.61 arc-90 Q7.2
N$13
  Bottom 0.813: Q9.2 43.18,9.53 arc-90 44.45,10.79 arc90 45.72,12.06 Q7.3 R18.P$1
N$14  (via drill 0.8)
  Top 0.813: v63.5,21.59 arc90 60.96,19.05 60.96,16.51 arc90 Q6.1
  Bottom 0.813: Q8.3 arc-90 63.5,7.87 Q6.1 | R15.P$1 arc90 66.04,21.59 v63.5,21.59
N$15
  Bottom 0.813: Q9.3 arc-90 40.64,7.87 Q7.1 40.64,17.78 arc-90 R16.P$2
N$16
  Top 0.813: Q11.3 133.35,53.34 arc-90 R26.P$1
N$17
  Top 0.813: Q12.3 140.97,42.55 arc90 139.7,43.81 arc-90 138.43,45.09 Q10.2 Q11.2 Q11.1
N$18
  Top 2.54: T1.1 arc90 149.86,126.49 149.86,144.03 arc-90 158.34,152.51 J3.N
N$19
  Bottom 0.813: C16.1 arc-90 114.3,45.24 R28.P$1
N$20
  Top 0.813: R29.P$1 132.08,43.18 arc-90 Q13.3
N$21
  Top 0.813: Q14.1 129.54,35.56 arc90 127,33.02 | 124.46,33.02 R31.P$2 | 124.46,33.02 127,33.02 | Q13.1 C15.2 124.46,33.02 | 127,33.02 Q15.2
N$22
  Top 0.813: R31.P$1 138.43,33.02 | 138.43,33.02 R32.P$1 | Q14.2 138.43,33.02
N$23
  Top 0.813: R32.P$2 154.94,37.8 arc90 R33.3
N$24  (via drill 0.8)
  Top 0.813: 149.22,40.34 R33.1 147.32,43.18 arc90 R30.P$2 | 149.22,40.34 R33.2 149.86,40.64 | 149.22,35.56 149.22,40.34 | Q14.3 149.22,35.56 | v149.22,26.04 149.22,35.56
  Bottom 0.813: Q16.2 arc-90 149.22,14.61 v149.22,26.04
N$25
  Bottom 0.813: Q17.2 127,9.53 arc-90 128.27,10.79 arc90 129.54,12.06 Q15.3 R36.P$2
N$26
  Top 0.813: R37.P$1 arc90 149.86,16.51 arc-90 Q16.3
  Bottom 0.813: Q18.2 149.86,9.53 arc-90 151.13,10.79 arc90 152.4,12.06 Q16.3
N$27
  Bottom 0.813: Q17.3 arc-90 124.46,7.87 Q15.1 R34.P$1
N$28
  Top 0.813: Q16.1 arc-90 144.78,16.51 144.78,19.05 arc-90 147.32,21.59 148.59,21.59 arc-90 R35.P$2
  Bottom 0.813: Q18.3 arc-90 147.32,7.87 Q16.1
N$29
  Bottom 0.813: R5.P$1 38.1,52.07 arc-90 C3.1 arc90 43.18,57.15 43.18,67.31 arc90 IC1.6
N$30
  Top 0.813: 15.24,152.4 R42.P$1 R41.P$2 15.24,160.02 arc-90 IC3.1 | 15.24,152.4 C27.1 C29.1 | D5.A 15.24,152.4
N$31
  pour Top (no thermals): 45.72,99.06 45.72,110.49 arc90 41.91,114.3 34.29,114.3 arc90 31.75,111.76 31.75,107.95 arc90 43.18,96.52 arc90
N$32
  Top 1.27: A1.3 R39.P$1
N$33
  Top 1.778: D3.C arc-90 60.96,149.86 60.96,137.16 | 60.96,137.16 60.96,135.89 arc-90 54.61,129.54 R40.P$1 | Q19.3 60.96,137.16
  pour Top (no thermals): 31.75,129.54 arc-90 34.29,132.08 43.18,132.08 arc-90 45.72,129.54 45.72,121.92 arc-90 43.18,119.38 34.29,119.38 arc-90 31.75,121.92
N$34  (via drill 0.8)
  Top 0.813: R40.P$2 C24.1 C26.+ arc-90 v49.53,142.24
  Bottom 0.813: v49.53,142.24 53.98,142.24 arc-90 Q19.2
N$35
  Top 0.813: C3.2 45.72,59.69 | 45.72,59.69 45.72,64.77 arc-90 IC1.2 | R2.P$1 45.72,59.69
N$36
  Top 0.813: 44.45,148.59 C28.1 | 44.45,148.59 C30.1 | 44.45,152.4 R44.P$1 R43.P$2 44.45,160.02 arc-90 IC4.1 | 44.45,152.4 44.45,148.59 | D6.A 44.45,152.4
N$37
  Top 1.778: Q19.1 arc-90 52.07,140.97 IC4.3
N$38
  Top 0.813: R3.P$1 R1.P$2 | C1.2 arc-90 52.07,59.69 R3.P$1 | IC1.3 arc-90 52.07,66.04 R3.P$1
N$39
  Top 0.813: R23.P$1 arc-90 Q10.3
N$40
  Top 2.54: J3.L arc90 156.21,131.11 156.21,123.19 arc90 158.75,120.65 arc-90 161.29,118.11 161.29,101.6 arc-90 157.48,97.79 F1.1
N$41
  Bottom 0.813: R24.P$1 154.94,52.07 arc90 C13.1 arc-90 149.86,57.15 149.86,64.77 arc-90 IC2.6
N$42
  Top 0.813: C13.2 147.32,59.69 | 147.32,59.69 147.32,67.31 arc90 IC2.2 | R21.P$1 147.32,59.69
N$43
  Top 0.813: IC2.3 arc90 140.97,63.5 R22.P$1 | R22.P$1 140.97,59.69 arc-90 C11.2 | R22.P$1 R20.P$2
N$44
  Top 2.54: F1.2 arc-90 129.72,107.95 149.86,107.95 arc-90 153.67,104.14 S1.S
N$45
  Bottom 2.54: T1.4 141.48,145.54 arc-90 149.86,137.16 149.86,115.57 arc90 153.67,111.76 arc-90 157.48,107.95 S1.UP-CONNECT
N$46
  Top 0.813: D7.A 5.71,85.72 arc-90 R45.P$2
OUT_L
  Top 0.813: C10.- 43.18,24.13 arc90 R19.P$2
  Bottom 0.813: J2.T arc-90 27.99,13.97 33.02,13.97 arc90 R19.P$2
  Bottom 1.778: C10.- C9.-
OUT_R  (via drill 0.8)
  Top 0.813: C19.- 149.86,24.13 arc-90 R38.P$2 | v140.97,6.99 C20.-
  Bottom 0.813: J2.R arc90 17.34,1.27 135.25,1.27 arc90 v140.97,6.99
  Bottom 1.778: C19.- C20.-
PL_L
  Top 0.813: 66.04,38.1 Q4.2 arc-90 68.58,43.18 70.48,43.18 arc90 73.03,45.72 arc-90 75.56,48.26 80.01,48.26 arc90 V1.1 | 66.04,38.1 C5.1 | Q3.1 arc90 59.69,38.1 66.04,38.1
PL_R
  Top 0.813: Q12.1 arc-90 133.35,38.1 127,38.1 | C15.1 127,38.1 | 127,38.1 Q13.2 arc90 124.46,43.18 122.56,43.18 arc-90 120.02,45.72 arc90 117.47,48.26 113.03,48.26 arc-90 V1.15
VCC  (via drill 0.8)
  Top 0.813: 34.29,90.17 34.29,86.36 arc-90 30.48,82.55 R45.P$1
  Top 1.778: IC1.7 C2.2 34.29,67.31 | 34.29,67.31 34.29,15.24 arc90 38.73,10.79 47.62,10.79 arc90 48.9,12.06 arc-90 50.8,13.97 58.42,13.97 arc-90 60.33,12.06 arc90 61.59,10.79 68.58,10.79 | IC2.7 C12.2 158.75,69.85 | 158.75,69.85 158.75,15.88 arc-90 153.67,10.79 145.41,10.79 arc-90 144.15,12.06 arc90 142.24,13.97 134.62,13.97 arc90 132.72,12.06 arc-90 131.44,10.79 129.54,10.79 | C8.1 arc-90 73.81,10.79 71.12,10.79 | 71.12,10.79 68.58,10.79 | Q8.1 68.33,10.54 arc-90 68.58,10.79 | C18.1 arc90 119.22,10.79 121.92,10.79 | 121.92,10.79 129.54,10.79 | Q17.1 129.29,10.54 arc-90 129.54,10.79 | R15.P$2 arc-90 71.12,26.67 71.12,10.79 | R34.P$2 arc90 121.92,26.67 121.92,10.79 | 52.07,76.2 R3.P$2 | 140.97,76.2 152.4,76.2 arc-90 158.75,69.85 | R22.P$2 140.97,76.2 | v16.51,134.62 v16.51,132.08 v16.51,129.54 16.51,107.95 arc90 34.29,90.17 49.53,90.17 arc-90 52.07,87.63 52.07,76.2 | 52.07,76.2 v66.04,76.2 v68.58,76.2 | v73.66,76.2 v76.2,76.2 140.97,76.2 | 52.07,76.2 40.64,76.2 arc90 34.29,69.85 34.29,67.31
  Bottom 1.778: 20.32,157.48 IC3.2 20.32,163.83 arc90 17.78,166.37 15.24,166.37 arc90 D5.C | 20.32,151.13 20.32,157.48 | 20.32,146.05 20.32,151.13 | 20.32,146.05 C31.1 | R41.P$1 20.32,157.48 | D4.A arc-90 27.94,151.13 20.32,151.13 | v16.51,129.54 v16.51,132.08 v16.51,134.62 16.51,142.24 arc-90 20.32,146.05 | v66.04,76.2 v68.58,76.2 v73.66,76.2 v76.2,76.2